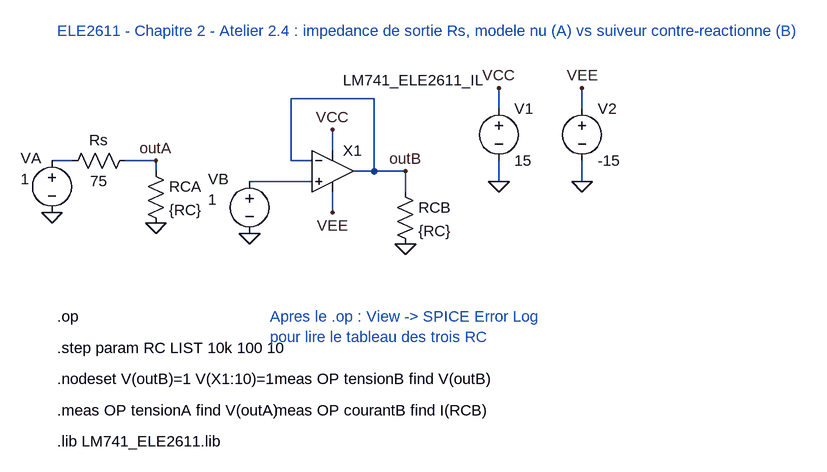
[diagram p0: schematic Ch2_Atelier_2_4_ImpedanceSortie.asc]
Ch2_Atelier_2_4_ImpedanceSortie.asc, the LTspice schematic file:
Version 4
SHEET 1 1200 1000
WIRE 64 240 96 240
WIRE 176 240 224 240
WIRE 224 240 224 256
WIRE 368 272 464 272
WIRE 528 256 560 256
WIRE 560 144 560 256
WIRE 432 144 560 144
WIRE 432 144 432 240
WIRE 432 240 464 240
WIRE 560 256 608 256
WIRE 608 256 608 288
WIRE 496 192 496 224
WIRE 496 288 496 320
WIRE 752 128 752 160
WIRE 752 240 752 272
WIRE 880 128 880 160
WIRE 880 240 880 272
FLAG 64 320 0
FLAG 224 240 outA
FLAG 224 336 0
FLAG 368 352 0
FLAG 496 192 VCC
FLAG 496 320 VEE
FLAG 608 256 outB
FLAG 608 368 0
FLAG 752 128 VCC
FLAG 752 272 0
FLAG 880 128 VEE
FLAG 880 272 0
SYMBOL voltage 64 224 R0
WINDOW 0 -48 12 Left 2
WINDOW 3 -48 44 Left 2
SYMATTR InstName VA
SYMATTR Value 1
SYMBOL res 192 224 R90
WINDOW 0 0 56 VBottom 2
WINDOW 3 32 56 VTop 2
SYMATTR InstName Rs
SYMATTR Value 75
SYMBOL res 208 240 R0
SYMATTR InstName RCA
SYMATTR Value {RC}
SYMBOL voltage 368 256 R0
WINDOW 0 -64 12 Left 2
WINDOW 3 -64 44 Left 2
SYMATTR InstName VB
SYMATTR Value 1
SYMBOL Opamps\\opamp2 496 192 R0
WINDOW 3 16 -76 Left 2
SYMATTR InstName X1
SYMATTR Value LM741_ELE2611_IL
SYMBOL res 592 272 R0
SYMATTR InstName RCB
SYMATTR Value {RC}
SYMBOL voltage 752 144 R0
SYMATTR InstName V1
SYMATTR Value 15
SYMBOL voltage 880 144 R0
SYMATTR InstName V2
SYMATTR Value -15
TEXT 72 40 Left 2 ;ELE2611 - Chapitre 2 - Atelier 2.4 : impedance de sortie Rs, modele nu (A) vs suiveur contre-reactionne (B)
TEXT 72 480 Left 2 !.op
TEXT 72 528 Left 2 !.step param RC LIST 10k 100 10
TEXT 72 576 Left 2 !.nodeset V(outB)=1 V(X1:10)=1
TEXT 72 624 Left 2 !.meas OP tensionA find V(outA)
TEXT 400 576 Left 2 !.meas OP tensionB find V(outB)
TEXT 400 624 Left 2 !.meas OP courantB find I(RCB)
TEXT 400 480 Left 2 ;Apres le .op : View -> SPICE Error Log\npour lire le tableau des trois RC
TEXT 72 672 Left 2 !.lib LM741_ELE2611.lib

The netlist it stands for:
* Ch2_Atelier_2_4_ImpedanceSortie.asc
VA N001 0 1
Rs outA N001 75
RCA outA 0 {RC}
VB N002 0 1
XX1 N002 outB VCC VEE outB LM741_ELE2611_IL  ; pins In+ In- V+ V- OUT
RCB outB 0 {RC}
V1 VCC 0 15
V2 VEE 0 -15
* ELE2611 - Chapitre 2 - Atelier 2.4 : impedance de sortie Rs, modele nu (A) vs suiveur contre-reactionne (B)
.op
.step param RC LIST 10k 100 10
.nodeset V(outB)=1 V(X1:10)=1
.meas OP tensionA find V(outA)
.meas OP tensionB find V(outB)
.meas OP courantB find I(RCB)
* Apres le .op : View -> SPICE Error Log
* pour lire le tableau des trois RC
.lib LM741_ELE2611.lib
.backanno
.end